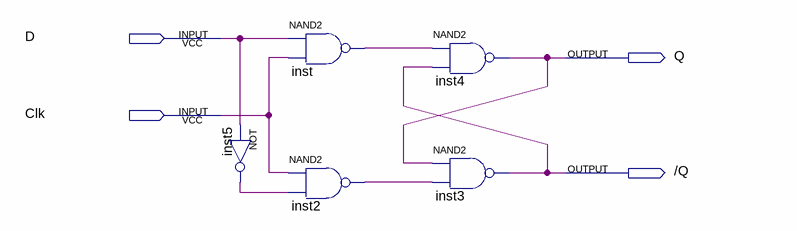
[diagram p0: schematic sheet]
// Quartus schematic D Flipflop.bdf as structural Verilog: 5 symbols, 4 pins
module \D_Flipflop  (
  input  D,
  input  Clk,
  output Q,
  output \/Q 
);

  wire inst2_out, inst5_out, inst_out;

  not inst5 (inst5_out, D);
  nand inst (inst_out, D, Clk);
  nand inst2 (inst2_out, Clk, inst5_out);
  nand inst4 (Q, inst_out, \/Q );
  nand inst3 (\/Q , Q, inst2_out);
endmodule
